# Altium schematic sheet W5500-EVB-Pico_V100.SchDoc: W5500-EVB-Pico
size A3; DrawnBy: Scott; Organization: WIZnet Co., Ltd.; Address1: 5F, Humax Village; Address2: Hwangseaul-ro, Bundang-Gu; Address3: Seongnam-Si, Gyeonggi-Do; Address4: South Korea; Revision: 1.0; SheetNumber: 1; SheetTotal: 1
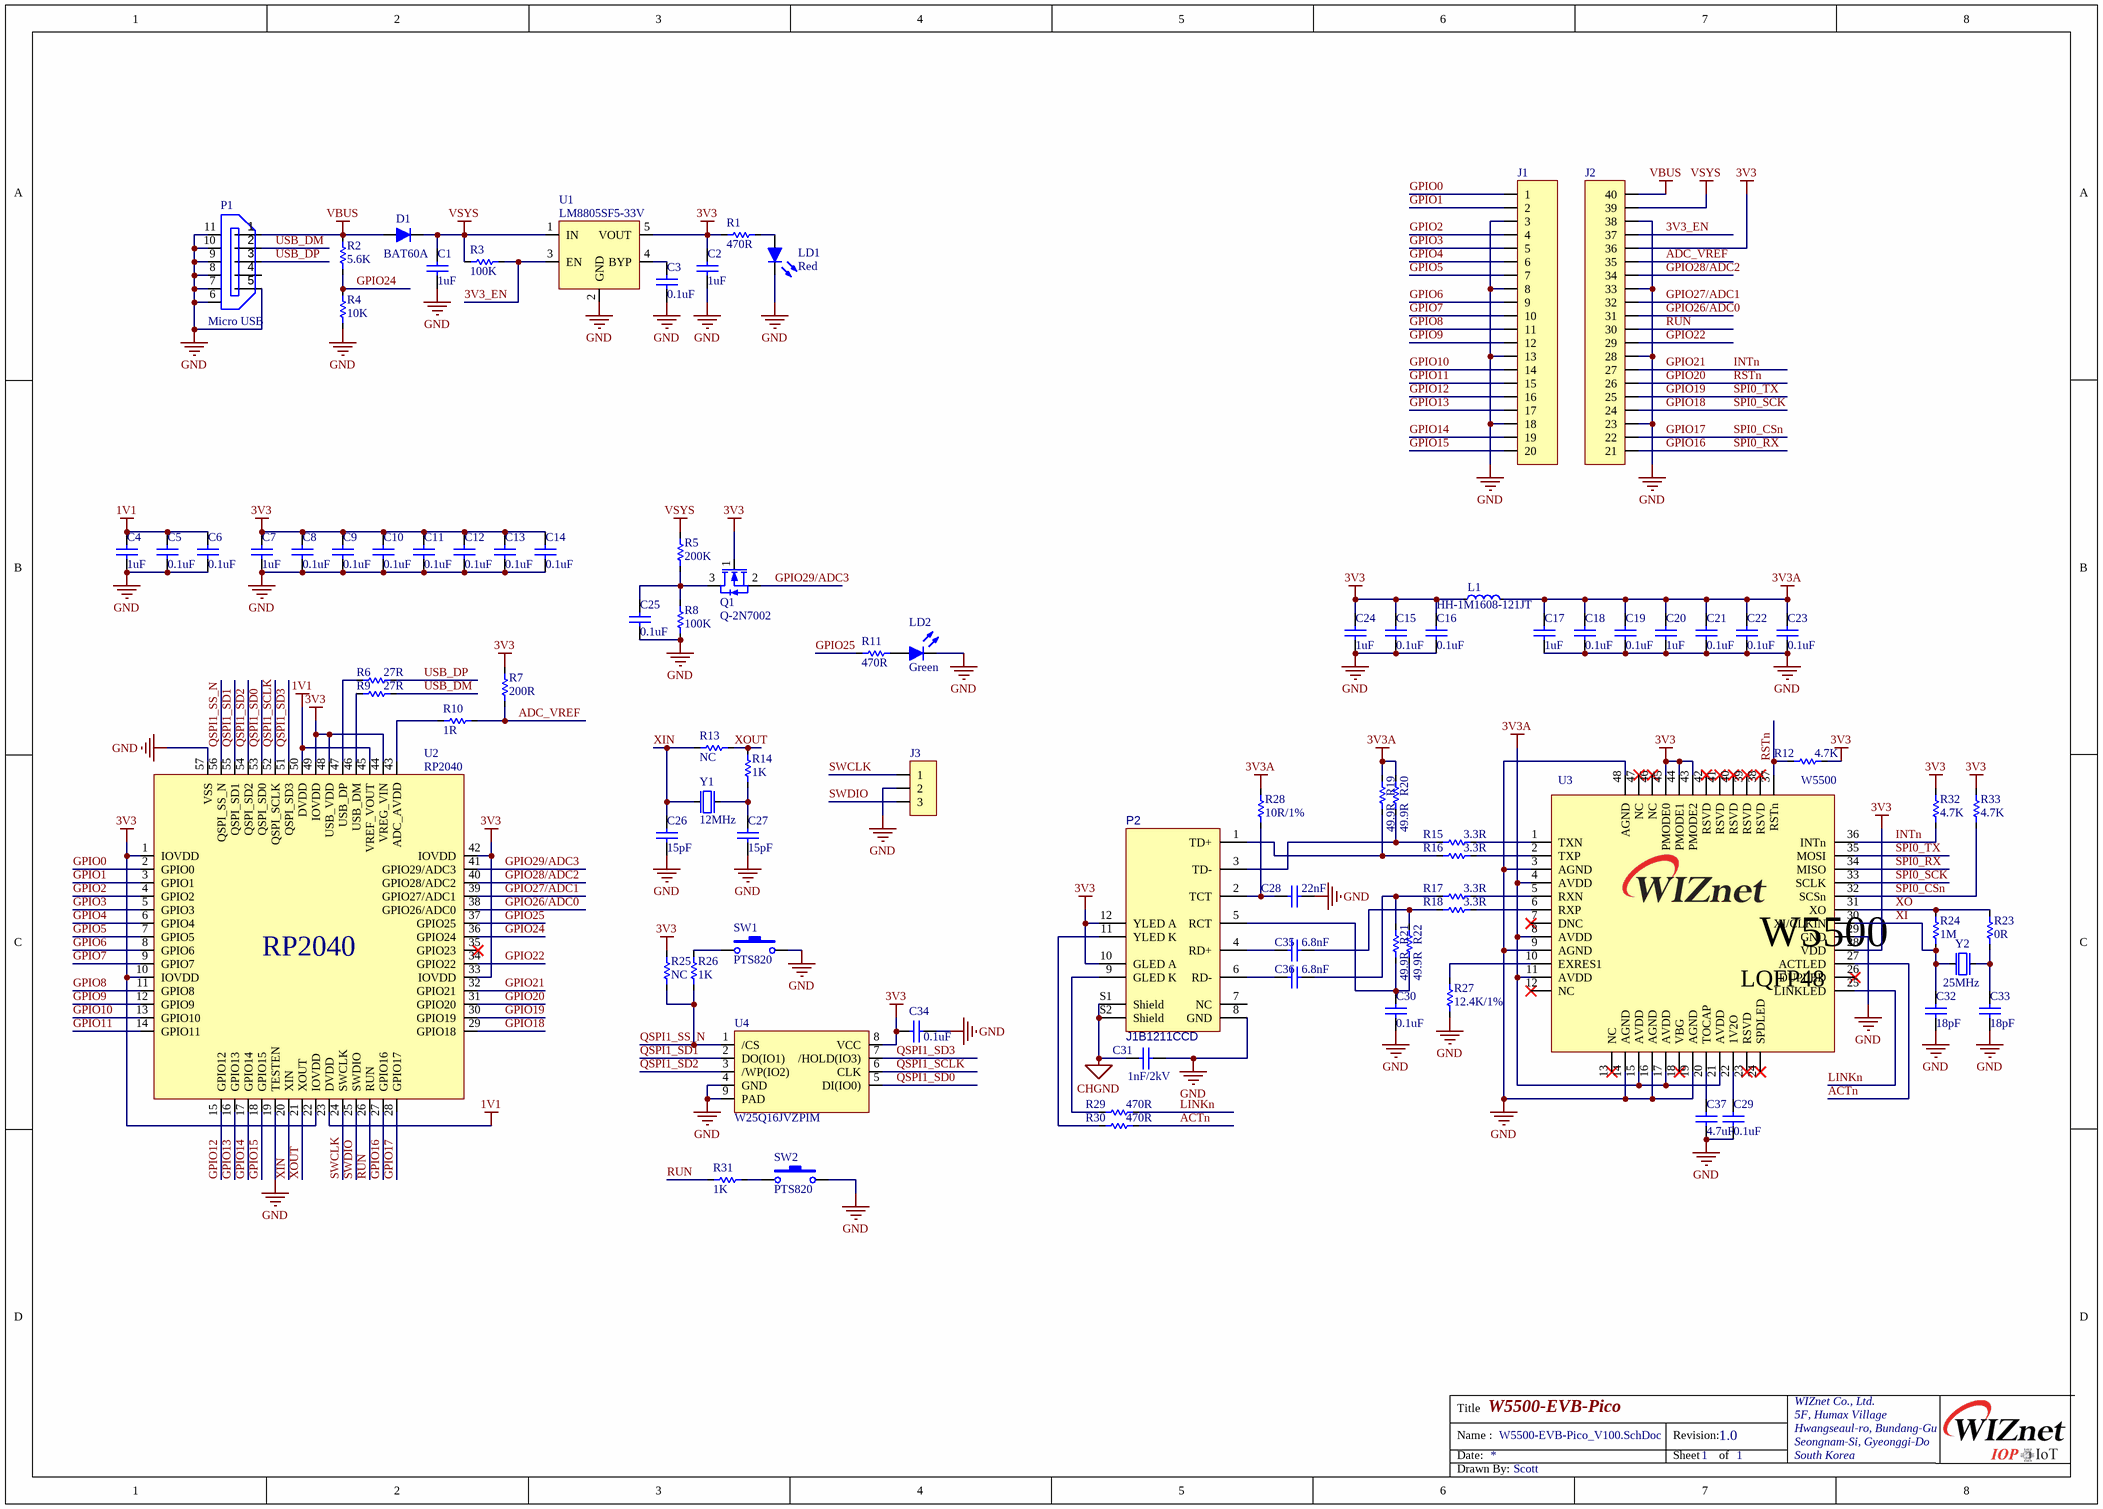
[diagram p0: W5500-EVB-Pico_V100.SchDoc]

## Parts
C1  1uF  [CAP-0402]
C2  1uF  [CAP-0402]
C3  0.1uF  [CAP-0402]
C4  1uF  [CAP-0402]
C5  0.1uF  [CAP-0402]
C6  0.1uF  [CAP-0402]
C7  1uF  [CAP-0402]
C8  0.1uF  [CAP-0402]
C9  0.1uF  [CAP-0402]
C10  0.1uF  [CAP-0402]
C11  0.1uF  [CAP-0402]
C12  0.1uF  [CAP-0402]
C13  0.1uF  [CAP-0402]
C14  0.1uF  [CAP-0402]
C15  0.1uF  [CAP-0402]
C16  0.1uF  [CAP-0402]
C17  1uF  [CAP-0402]
C18  0.1uF  [CAP-0402]
C19  0.1uF  [CAP-0402]
C20  1uF  [CAP-0402]
C21  0.1uF  [CAP-0402]
C22  0.1uF  [CAP-0402]
C23  0.1uF  [CAP-0402]
C24  1uF  [CAP-0402]
C25  0.1uF  [CAP-0402]
C26  15pF  [CAP-0402]
C27  15pF  [CAP-0402]
C28  22nF  [CAP-0402]
C29  0.1uF  [CAP-0402]
C30  0.1uF  [CAP-0402]
C31  1nF/2kV  [CAP-1808]
C32  18pF  [CAP-0402]
C33  18pF  [CAP-0402]
C34  0.1uF  [CAP-0402]
C35  6.8nF  [CAP-0402]
C36  6.8nF  [CAP-0402]
C37  4.7uF  [CAP-0805]
D1  BAT60A  [SOD-323(1-C,2-A)]
J1  2.54mm 1x20 Pin Header DIP  [IDC-1X20]  (value not drawn)
J2  2.54mm 1x20 Pin Header DIP  [IDC-1X20]  (value not drawn)
J3  2.54mm 1x3 Pin Header DIP  [IDC-1X3]  (value not drawn)
L1  HH-1M1608-121JT  [IND-0603]
LD1  Red  [LED-0603-RED]
LD2  Green  [LED-0603-GREEN]
P1  Micro USB  [Micro 5P B DBX 6.4]
P2  J1B1211CCD  [RJ45-J1B1211CCD]
Q1  Q-2N7002  [SOT23-3L]
R1  470R  [RES-0402]
R2  5.6K  [RES-0402]
R3  100K  [RES-0402]
R4  10K  [RES-0402]
R5  200K  [RES-0402]
R6  27R  [RES-0402]
R7  200R  [RES-0402]
R8  100K  [RES-0402]
R9  27R  [RES-0402]
R10  1R  [RES-0402]
R11  470R  [RES-0402]
R12  4.7K  [RES-0402]
R13  NC  [RES-0402]
R14  1K  [RES-0402]
R15  3.3R  [RES-0402]
R16  3.3R  [RES-0402]
R17  3.3R  [RES-0402]
R18  3.3R  [RES-0402]
R19  49.9R  [RES-0402]
R20  49.9R  [RES-0402]
R21  49.9R  [RES-0402]
R22  49.9R  [RES-0402]
R23  0R  [RES-0402]
R24  1M  [RES-0402]
R25  NC  [RES-0402]
R26  1K  [RES-0402]
R27  12.4K/1%  [RES-0402]
R28  10R/1%  [RES-0402]
R29  470R  [RES-0402]
R30  470R  [RES-0402]
R31  1K  [RES-0402]
R32  4.7K  [RES-0402]
R33  4.7K  [RES-0402]
SW1  PTS820  [PTS820]
SW2  PTS820  [PTS820]
U1  LM8805SF5-33V  [SOT-23-5L]
U2  RP2040  [RP2040_QFN56(0.4/7X7)]
U3  W5500  [W5500-LQFP48]
U4  W25Q16JVZPIM  [WSON8(6X5_1.27)]
Y1  12MHz  [OSC-TZ1067B]
Y2  25MHz  [OSC-82J0626]

## Nets
1V1: C4.2 C5.2 C6.2 U2.23(DVDD) U2.45(VREF_VOUT) U2.50(DVDD)
3V3: C2.2 C7.2 C8.2 C9.2 C10.2 C11.2 C12.2 C13.2 C14.2 C15.2 C16.2 C24.2 C34.2 J2.16(36) L1.1 P2.10(GLED_A) P2.12(YLED_A) Q1.1(G) R1.1 R7.1 R12.2 R25.2 R32.1 R33.1 U1.5(VOUT) U2.1(IOVDD) U2.10(IOVDD) U2.22(IOVDD) U2.33(IOVDD) U2.42(IOVDD) U2.44(VREG_VIN) U2.48(USB_VDD) U2.49(IOVDD) U3.28(VDD) U3.43(PMODE2) U3.44(PMODE1) U3.45(PMODE0) U4.8(VCC)
3V3A: C17.2 C18.2 C19.2 C20.2 C21.2 C22.2 C23.2 L1.2 R19.2 R20.2 R28.1 U3.4(AVDD) U3.8(AVDD) U3.11(AVDD) U3.15(AVDD) U3.17(AVDD) U3.21(AVDD)
CHGND: C31.2 P2.S1(Shield) P2.S2(Shield)
GND: C1.1 C2.1 C3.1 C4.1 C5.1 C6.1 C7.1 C8.1 C9.1 C10.1 C11.1 C12.1 C13.1 C14.1 C15.1 C16.1 C17.1 C18.1 C19.1 C20.1 C21.1 C22.1 C23.1 C24.1 C25.2 C26.2 C27.2 C28.1 C29.1 C30.1 C31.1 C32.1 C33.1 C34.1 C37.1 J1.3 J1.8 J1.13 J1.18 J2.3(23) J2.8(28) J2.13(33) J2.18(38) J3.2 LD1.2(K) LD2.2(K) P1.5 P1.6 P1.7 P1.8 P1.9 P1.10 P1.11 P2.8(GND) R4.1 R8.1 R27.2 SW1.2 SW2.2 U1.2(GND) U2.19(TESTEN) U2.57(VSS) U3.3(AGND) U3.9(AGND) U3.14(AGND) U3.16(AGND) U3.19(AGND) U3.29(GND) U3.48(AGND) U4.4(GND) U4.9(PAD) Y1.2 Y1.4 Y2.2(GND) Y2.4(GND)
VBUS: D1.2(A) J2.20(40) P1.1 R2.2
VSYS: C1.2 D1.1(K) J2.19(39) R3.1 R5.2 U1.1(IN)
3V3_EN: J2.17(37) R3.2 U1.3(EN)
ACTn: R30.2 U3.27(ACTLED)
ADC_VREF: J2.15(35) R7.2 R10.2
GPIO0: J1.1 U2.2(GPIO0)
GPIO1: J1.2 U2.3(GPIO1)
GPIO2: J1.4 U2.4(GPIO2)
GPIO3: J1.5 U2.5(GPIO3)
GPIO4: J1.6 U2.6(GPIO4)
GPIO5: J1.7 U2.7(GPIO5)
GPIO6: J1.9 U2.8(GPIO6)
GPIO7: J1.10 U2.9(GPIO7)
GPIO8: J1.11 U2.11(GPIO8)
GPIO9: J1.12 U2.12(GPIO9)
GPIO10: J1.14 U2.13(GPIO10)
GPIO11: J1.15 U2.14(GPIO11)
GPIO12: J1.16 U2.15(GPIO12)
GPIO13: J1.17 U2.16(GPIO13)
GPIO14: J1.19 U2.17(GPIO14)
GPIO15: J1.20 U2.18(GPIO15)
GPIO16: J2.1(21) U2.27(GPIO16) U3.34(MISO)  [also labelled SPI0_RX]
GPIO17: J2.2(22) R33.2 U2.28(GPIO17) U3.32(SCSn)  [also labelled SPI0_CSn]
GPIO18: J2.4(24) U2.29(GPIO18) U3.33(SCLK)  [also labelled SPI0_SCK]
GPIO19: J2.5(25) U2.30(GPIO19) U3.35(MOSI)  [also labelled SPI0_TX]
GPIO20: J2.6(26) R12.1 U2.31(GPIO20) U3.37(RSTn)  [also labelled RSTn]
GPIO21: J2.7(27) R32.2 U2.32(GPIO21) U3.36(INTn)  [also labelled INTn]
GPIO22: J2.9(29) U2.34(GPIO22)
GPIO24: R2.1 R4.2 U2.36(GPIO24)
GPIO25: R11.2 U2.37(GPIO25)
GPIO26/ADC0: J2.11(31) U2.38(GPIO26/ADC0)
GPIO27/ADC1: J2.12(32) U2.39(GPIO27/ADC1)
GPIO28/ADC2: J2.14(34) U2.40(GPIO28/ADC2)
GPIO29/ADC3: Q1.2(S) U2.41(GPIO29/ADC3)
LINKn: R29.2 U3.25(LINKLED)
QSPI1_SCLK: U2.52(QSPI_SCLK) U4.6(CLK)
QSPI1_SD0: U2.53(QSPI_SD0) U4.5(DI(IO0))
QSPI1_SD1: U2.55(QSPI_SD1) U4.2(DO(IO1))
QSPI1_SD2: U2.54(QSPI_SD2) U4.3(/WP(IO2))
QSPI1_SD3: U2.51(QSPI_SD3) U4.7(/HOLD(IO3))
QSPI1_SS_N: R25.1 R26.1 U2.56(QSPI_SS_N) U4.1(/CS)
RUN: J2.10(30) R31.2 U2.26(RUN)
SWCLK: J3.1 U2.24(SWCLK)
SWDIO: J3.3 U2.25(SWDIO)
USB_DM: P1.2 R9.1
USB_DP: P1.3 R6.1
XI: C32.2 R24.1 U3.30(XI/CLKIN) Y2.1(inp)
XIN: C26.1 R13.2 U2.20(XIN) Y1.1(inp)
XO: R23.2 R24.2 U3.31(XO)
XOUT: R13.1 R14.2 U2.21(XOUT)
NetC3_2: C3.2 U1.4(BYP)
NetC25_1: C25.1 Q1.3(D) R5.1 R8.2
NetC27_1: C27.1 R14.1 Y1.3(out)
NetC28_2: C28.2 P2.2(TCT) R28.2
NetC29_2: C29.2 U3.22(1V2O)
NetC30_2: C30.2 P2.5(RCT) R21.1 R22.1
NetC33_2: C33.2 R23.1 Y2.3(out)
NetC35_1: C35.1 R18.1 R22.2
NetC35_2: C35.2 P2.4(RD+)
NetC36_1: C36.1 R17.1 R21.2
NetC36_2: C36.2 P2.6(RD-)
NetC37_2: C37.2 U3.20(TOCAP)
NetLD1_1: LD1.1(A) R1.2
NetLD2_1: LD2.1(A) R11.1
NetP2_1: P2.1(TD+) R16.1 R19.1
NetP2_3: P2.3(TD-) R15.1 R20.1
NetP2_9: P2.9(GLED_K) R29.1
NetP2_11: P2.11(YLED_K) R30.1
NetR6_2: R6.2 U2.47(USB_DP)
NetR9_2: R9.2 U2.46(USB_DM)
NetR10_1: R10.1 U2.43(ADC_AVDD)
NetR15_2: R15.2 U3.1(TXN)
NetR16_2: R16.2 U3.2(TXP)
NetR17_2: R17.2 U3.5(RXN)
NetR18_2: R18.2 U3.6(RXP)
NetR26_2: R26.2 SW1.1
NetR27_1: R27.1 U3.10(EXRES1)
NetR31_1: R31.1 SW2.1

Not connected (* = marked no-connect by the designer): P1 4; P2 7(NC); U2 35(GPIO23)*; U3 7(DNC)* 12(NC)* 13(NC)* 18(VBG)* 23(RSVD)* 24(SPDLED)* 26(DUPLED)* 38(RSVD)* 39(RSVD)* 40(RSVD)* 41(RSVD)* 42(RSVD)* 46(NC)* 47(NC)*

## Notes on the sheet
- Title
- Date:
- Name :
- Revision:
- Sheet
- of
- Drawn By:
- (in symbol W5500) LQFP48

## Library data of the parts
C1-C30 C32-C36 = CAP-0402: Ceramic CAP 0402(1005)
C31 = CAP-1808: Ceramic CAP 1808(4520)
C37 = CAP-0805: Ceramic CAP 0805(2012)
D1 = DIODE-BAT60A: Silicon Schottky Diode
L1 = IND-0603: Inductor 0603(1608)
LD1 LD2 = LED-0603
P1 = Micro USB 5P DBX6.4: Micro USB B Connector SMD
Q1 = Q-2N7002: N-Channel 60-V (D-S) MOSFET
R1-R33 = RES-0402
SW1 SW2 = ITS-1107(SMD): TACT Switch (SMD)
U1 = LM8805SF5-33V: 600mA CMOS LDO Regulator
U2 = RP2040: Raspverry Pi, Dual ARM Cortex-M0+ @ 133MHz
U3 = W5500: WIZnet Hardwired TCP/IP Chip
U4 = W25Q16JVZPIM: 3V 16M-BIT / SERIAL FLASH MEMORY WITH / DUAL/QUAD SPI, QPI & DTR
Y1 = OSC-TZ1067B-12MHz: X-tal 12MHz,3.2x2.5 SMD, CL=20pF
Y2 = OSC-82J0626-25MHz: X-tal 25MHz,3.2x2.5 SMD, CL=18pF